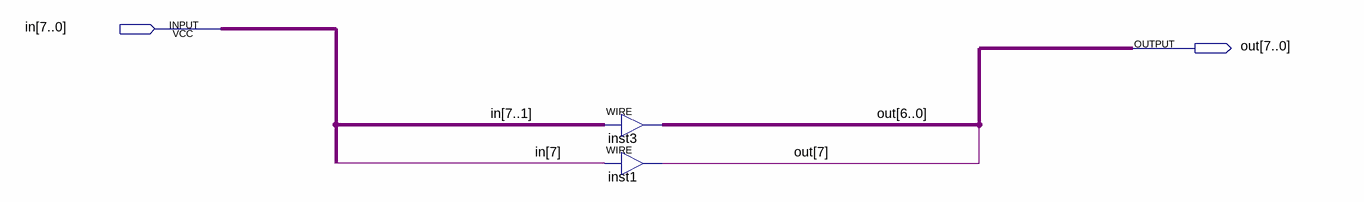
[diagram p0: schematic sheet]
// Quartus schematic right_shift_8bit.bdf as structural Verilog: 2 symbols, 2 pins
module right_shift_8bit (
  input  [7:0] in,
  output [7:0] out
);

  assign out[6:0] = in[7:1];  // WIRE inst3
  assign out[7] = in[7];  // WIRE inst1
endmodule
